# Altium schematic sheet Battery_Interface.SchDoc
size A4; Organization: TESLA Motors, INC; Address1: 3500 Deer Creek Road; Address2: Palo Alto, CA; Address4: U.S.A.; SheetNumber: 2; SheetTotal: 8
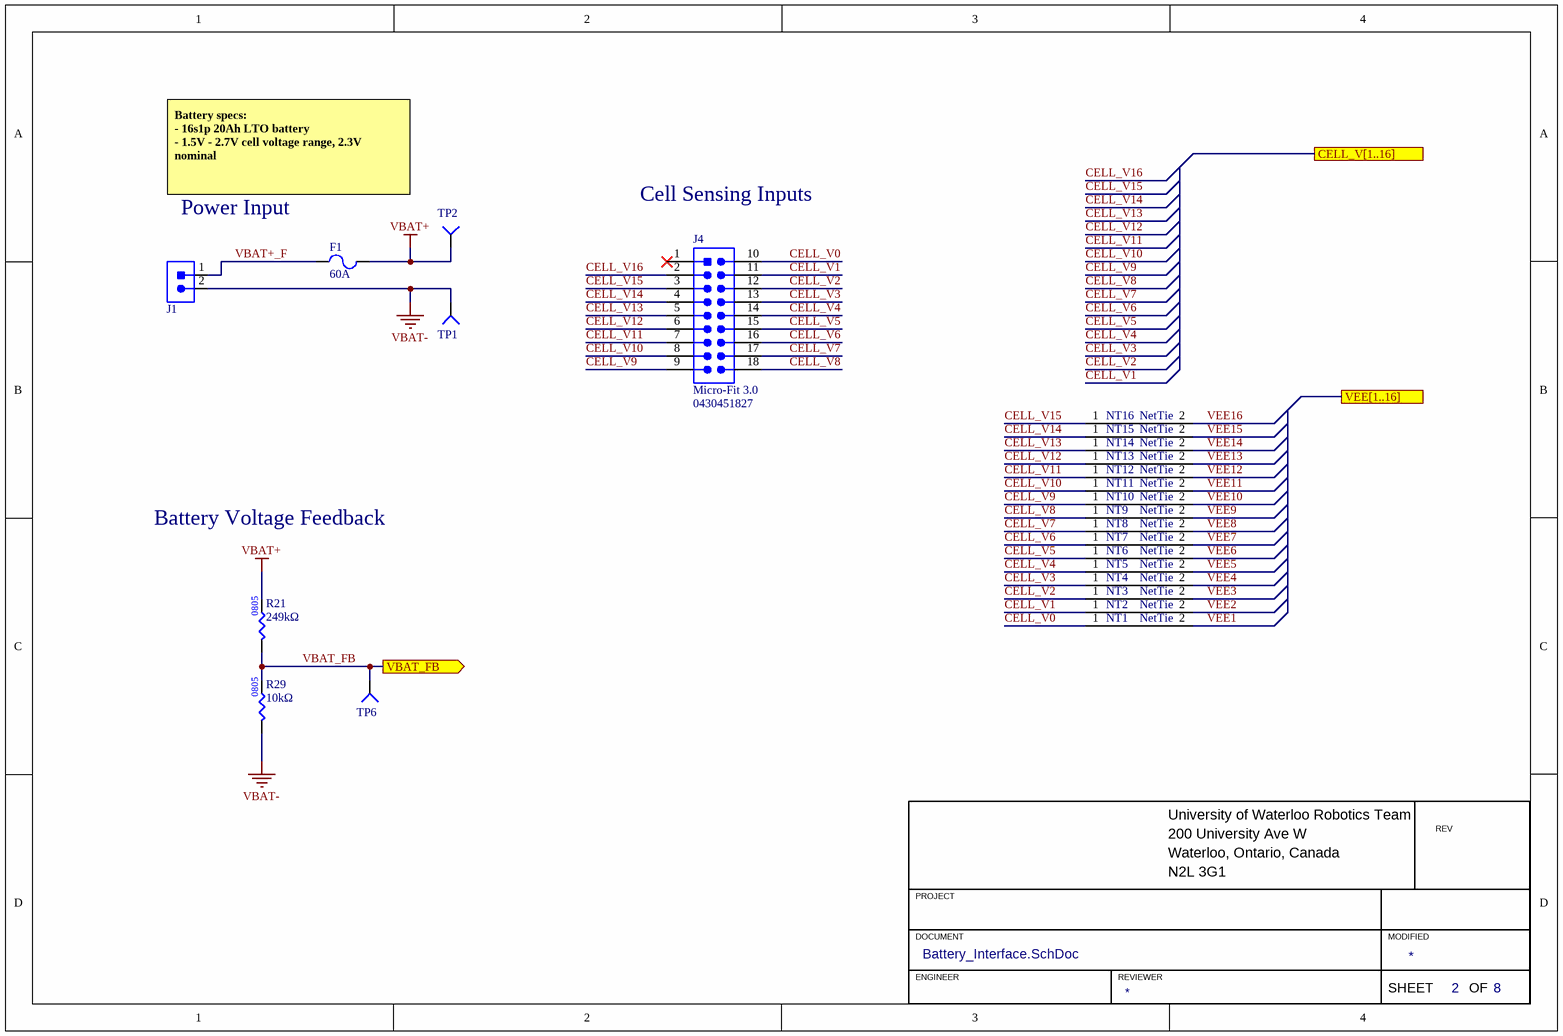
[diagram p0: Battery_Interface.SchDoc]

## Parts
F1  Current Rating: 60A  [FUSE_3812_BOURNS]  (hidden comment: FUSE_60A_3812)
J1  CON_2POS_XT90  [XT90]  (value not drawn)
J4  Family: Micro-Fit 3.0  [MOLEX-0430451827]  (hidden comment: 0430451827)
NT1  NetTie  [NET_TIE]  (value not drawn)
NT2  NetTie  [NET_TIE]  (value not drawn)
NT3  NetTie  [NET_TIE]  (value not drawn)
NT4  NetTie  [NET_TIE]  (value not drawn)
NT5  NetTie  [NET_TIE]  (value not drawn)
NT6  NetTie  [NET_TIE]  (value not drawn)
NT7  NetTie  [NET_TIE]  (value not drawn)
NT8  NetTie  [NET_TIE]  (value not drawn)
NT9  NetTie  [NET_TIE]  (value not drawn)
NT10  NetTie  [NET_TIE]  (value not drawn)
NT11  NetTie  [NET_TIE]  (value not drawn)
NT12  NetTie  [NET_TIE]  (value not drawn)
NT13  NetTie  [NET_TIE]  (value not drawn)
NT14  NetTie  [NET_TIE]  (value not drawn)
NT15  NetTie  [NET_TIE]  (value not drawn)
NT16  NetTie  [NET_TIE]  (value not drawn)
R21  value 249kΩ  [RES0805]  (hidden comment: RES_249kΩ_0805_1%)
R29  value 10kΩ  [RES0805]  (hidden comment: RES_10kΩ_0805_5%)
TP1  TESTPOINT_SMD_LOOP  [S1751-46R]  (value not drawn)
TP2  TESTPOINT_SMD_LOOP  [S1751-46R]  (value not drawn)
TP6  TESTPOINT_1MM_CIRCLE  [TESTPOINT_CIRCLE_1MM]  (value not drawn)  (no BOM)

## Ports
CELL_V[1..16], VBAT_FB (out), VEE[1..16]

## Nets
VBAT+: F1.2 R21.2 TP2.1(=value)
VBAT-: J1.2 R29.1 TP1.1(=value)
CELL_V0: J4.10 NT1.1
CELL_V1: J4.11 NT2.1
CELL_V2: J4.12 NT3.1
CELL_V3: J4.13 NT4.1
CELL_V4: J4.14 NT5.1
CELL_V5: J4.15 NT6.1
CELL_V6: J4.16 NT7.1
CELL_V7: J4.17 NT8.1
CELL_V8: J4.18 NT9.1
CELL_V9: J4.9 NT10.1
CELL_V10: J4.8 NT11.1
CELL_V11: J4.7 NT12.1
CELL_V12: J4.6 NT13.1
CELL_V13: J4.5 NT14.1
CELL_V14: J4.4 NT15.1
CELL_V15: J4.3 NT16.1
CELL_V16: J4.2
VBAT+_F: F1.1 J1.1
VBAT_FB: R21.1 R29.2 TP6.1(=value) ; port VBAT_FB
VEE1: NT1.2
VEE2: NT2.2
VEE3: NT3.2
VEE4: NT4.2
VEE5: NT5.2
VEE6: NT6.2
VEE7: NT7.2
VEE8: NT8.2
VEE9: NT9.2
VEE10: NT10.2
VEE11: NT11.2
VEE12: NT12.2
VEE13: NT13.2
VEE14: NT14.2
VEE15: NT15.2
VEE16: NT16.2

Not connected (* = marked no-connect by the designer): J4 1*

## Notes on the sheet
- Battery specs:
  - 16s1p 20Ah LTO battery
  - 1.5V - 2.7V cell voltage range, 2.3V nominal
- Power Input
- Cell Sensing Inputs
- Battery Voltage Feedback
- University of Waterloo Robotics Team
- 200 University Ave W
- REV
- PROJECT
- Waterloo, Ontario, Canada
- N2L 3G1
- DOCUMENT
- ENGINEER
- REVIEWER
- MODIFIED
- SHEET
- OF

## Library data of the parts
F1 = FUSE_60A_3812: FUSE BRD 60A 250VAC 100VDC 2SMD; Manufacturer 1: Bourns Inc.; Manufacturer Part Number 1: SF-3812F6000T-2; Package/Footprint: 3812; Mounting Type: SMD; Verified: No; Supplier 1: Digi-Key; Supplier Part Number 1: 118-SF-3812F6000T-2CT-ND
J1 = CON_2POS_XT90: HIGH QUALITY GOLD PLATED XT90 MA; Manufacturer 1: DFRobot; Manufacturer Part Number 1: FIT0588; Mounting Type: TH; Package/Footprint: XT90; Supplier 1: Digi-Key; Supplier Part Number 1: 1738-1438-ND
J4 = CON_MOLEX-HDR_9x2_TH: CONN HEADER VERT 18POS 3MM; Manufacturer 1: Molex; Voltage Rating: 250VAC; Current Rating: 5A; Pitch: 3mm; Supplier 1: Digi-Key; Supplier Part Number 1: WM10723-ND; Manufacturer Part Number 1: 0430451827
R21 = RES_249kΩ_0805_1%: RES 249K OHM 1% 1/8W 0805; Manufacturer 1: Yageo; Manufacturer Part Number 1: RC0805FR-07249KL; Package/Footprint: 0805; Supplier Part Number 1: 311-249KCRCT-ND; Supplier 1: Digi-Key; Mounting Type: SMD; LCSC Part #: C25825
R29 = RES_10kΩ_0805_5%: RES 10K OHM 5% 1/8W 0805; Manufacturer 1: Panasonic Electronic Components; Manufacturer Part Number 1: ERJ-6GEYJ103V; Package/Footprint: 0805; Supplier 1: Digi-Key; Supplier Part Number 1: P10KACT-ND; LCSC Part #: C17414; Mounting Type: SMD
TP1 TP2 = TESTPOINT_SMD_LOOP: TESTPOINT SMD LOOP; Manufacturer 1: Harwin; Supplier 1: Digi-Key; Manufacturer Part Number 1: S1751-46R; Mounting Type: SMD; Package/Footprint: SMD; Supplier Part Number 1: 952-1478-1-ND
TP6 = TESTPOINT_1MM_CIRCLE: TESTPOINT 1MM CIRCLE